# Altium schematic sheet 7_Analogue.SchDoc
size 420 x 297 mm; SheetNumber: 7; SheetTotal: 7
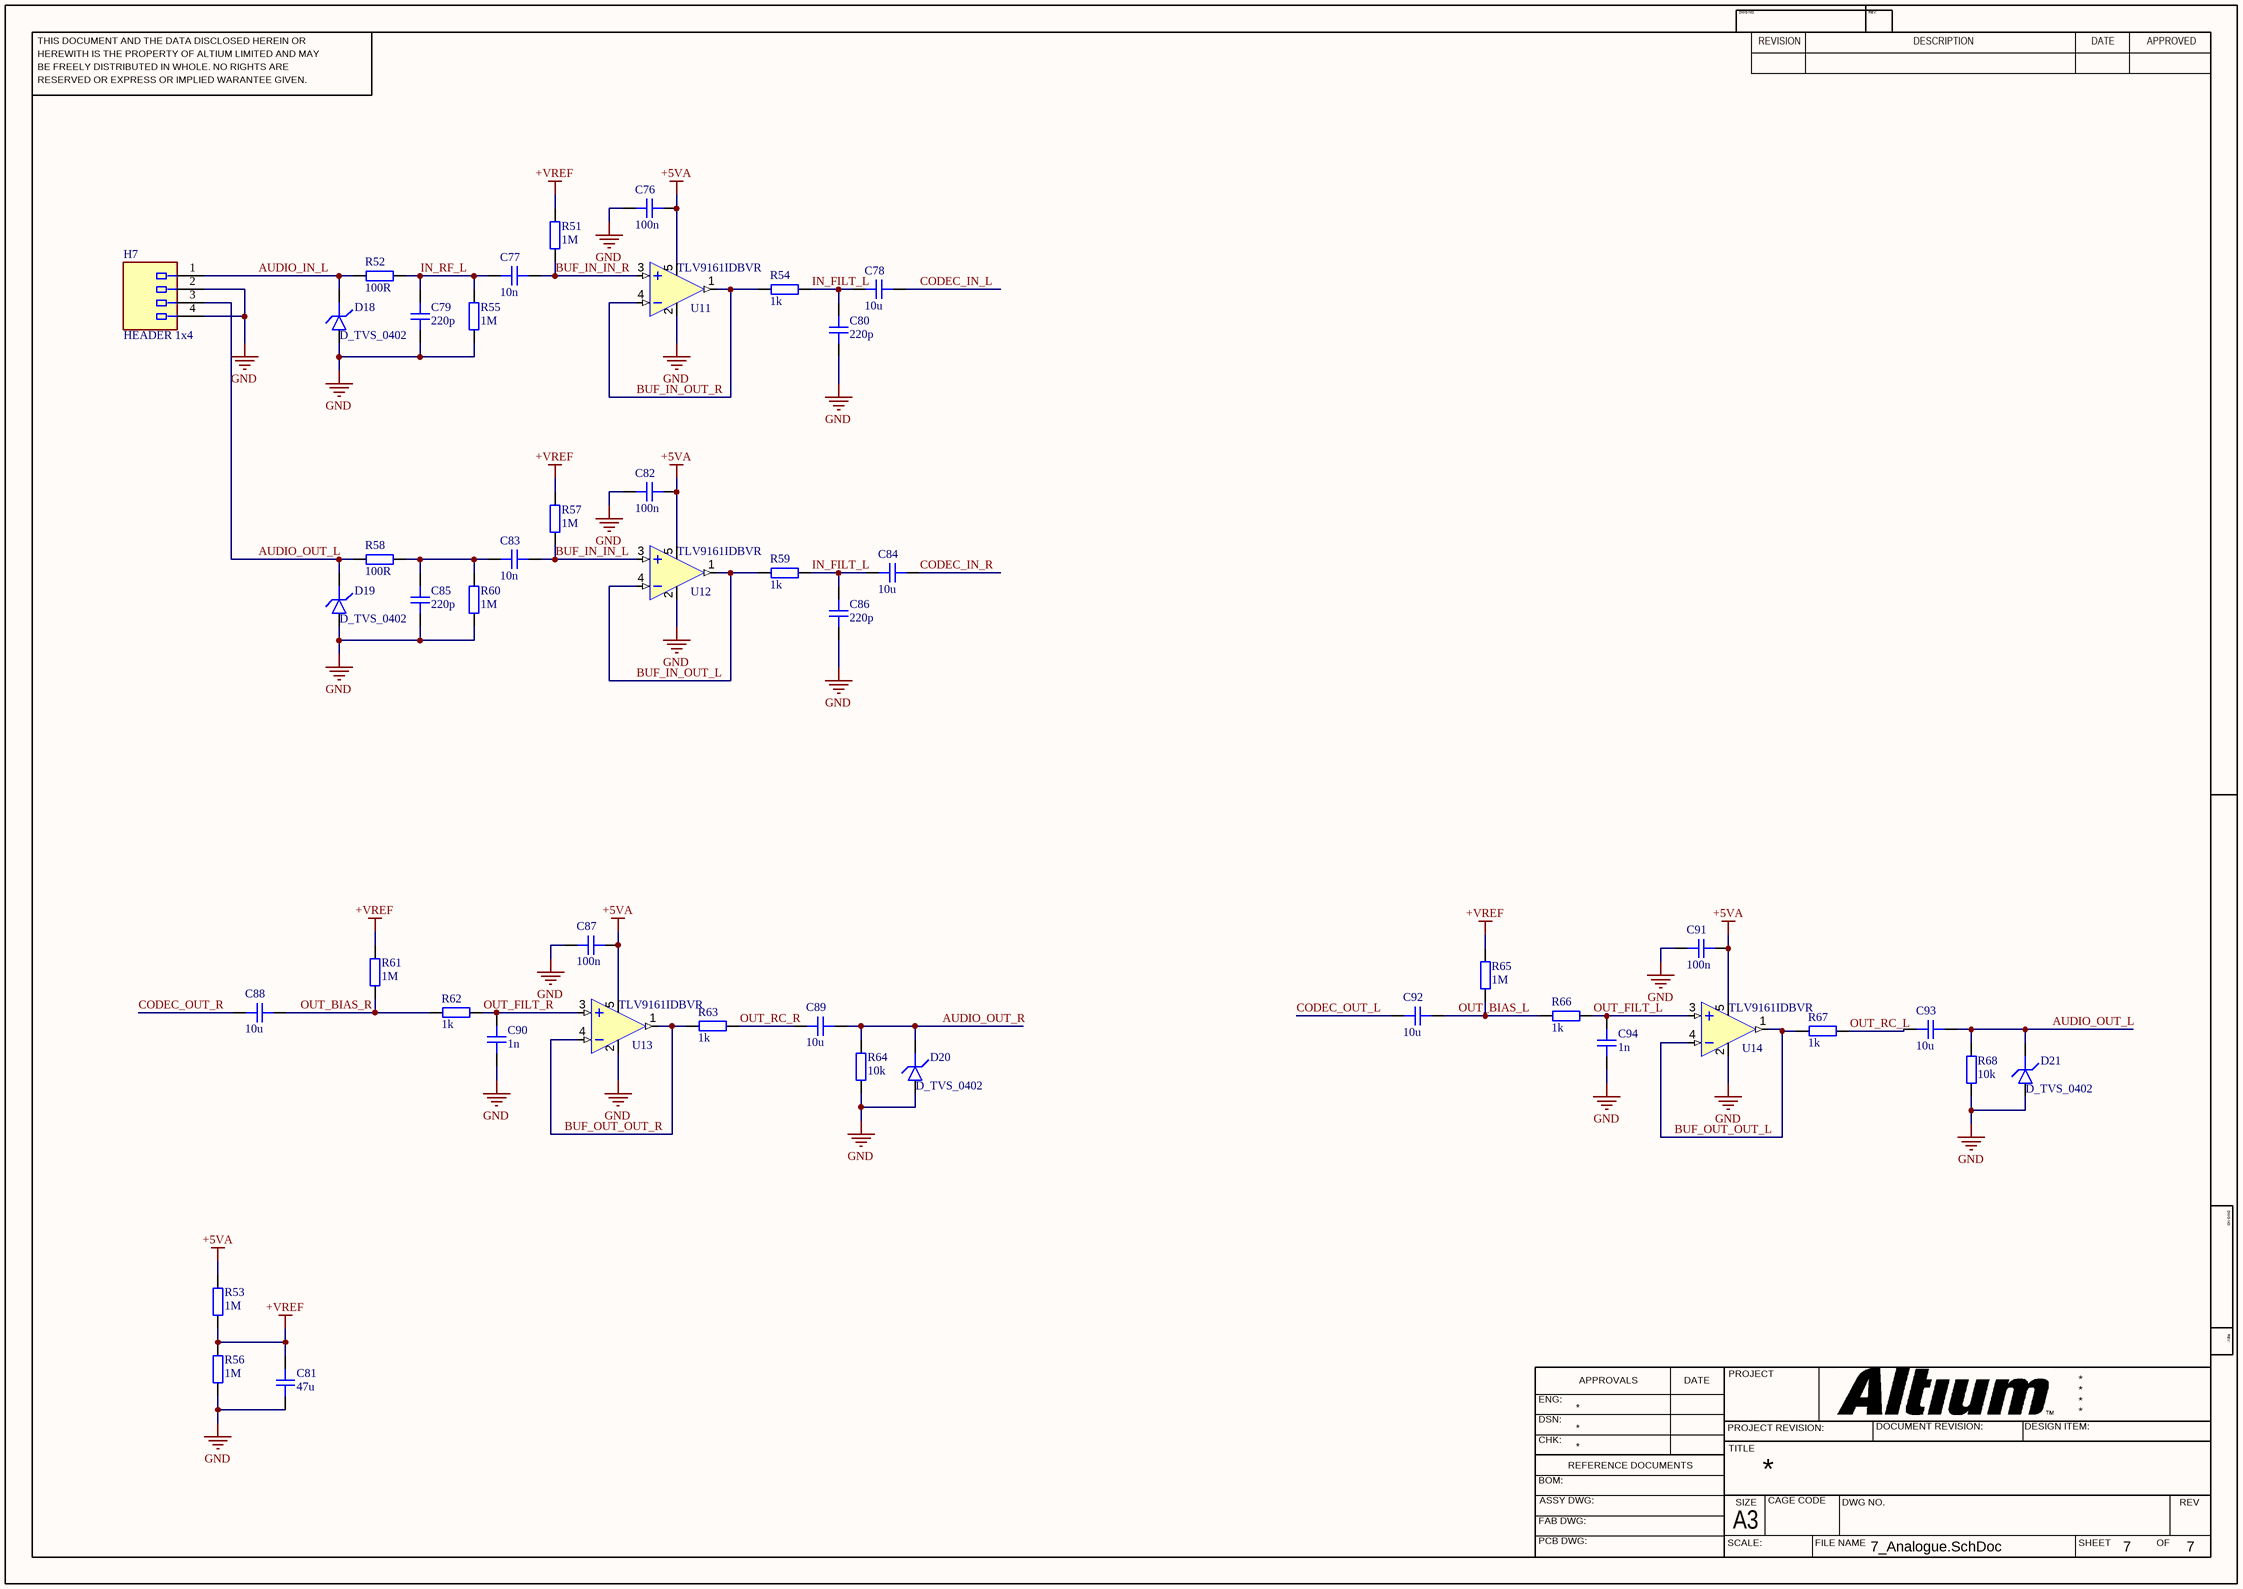
[diagram p0: 7_Analogue.SchDoc]

## Parts
C76  100n  [CAP_0402]
C77  10n  [CAP_0402]
C78  10u  [CAP_0402]
C79  220p  [CAP_0402]
C80  220p  [CAP_0402]
C81  47u  [CAP_0402]
C82  100n  [CAP_0402]
C83  10n  [CAP_0402]
C84  10u  [CAP_0402]
C85  220p  [CAP_0402]
C86  220p  [CAP_0402]
C87  100n  [CAP_0402]
C88  10u  [CAP_0402]
C89  10u  [CAP_0402]
C90  1n  [CAP_0402]
C91  100n  [CAP_0402]
C92  10u  [CAP_0402]
C93  10u  [CAP_0402]
C94  1n  [CAP_0402]
D18  D_TVS_0402  [D_0402]
D19  D_TVS_0402  [D_0402]
D20  D_TVS_0402  [D_0402]
D21  D_TVS_0402  [D_0402]
H7  HEADER 1x4  [053048-0410]
R51  1M  [RES_0402]
R52  100R  [RES_0402]
R53  1M  [RES_0402]
R54  1k  [RES_0402]
R55  1M  [RES_0402]
R56  1M  [RES_0402]
R57  1M  [RES_0402]
R58  100R  [RES_0402]
R59  1k  [RES_0402]
R60  1M  [RES_0402]
R61  1M  [RES_0402]
R62  1k  [RES_0402]
R63  1k  [RES_0402]
R64  10k  [RES_0402]
R65  1M  [RES_0402]
R66  1k  [RES_0402]
R67  1k  [RES_0402]
R68  10k  [RES_0402]
U11  TLV9161IDBVR  [SOT-23-5]
U12  TLV9161IDBVR  [SOT-23-5]
U13  TLV9161IDBVR  [SOT-23-5]
U14  TLV9161IDBVR  [SOT-23-5]

## Nets
+5VA: C76.1 C82.1 C87.1 C91.1 R53.2 U11.5(V+) U12.5(V+) U13.5(V+) U14.5(V+)
+VREF: C81.1 R51.2 R53.1 R56.2 R57.2 R61.2 R65.2
GND: C76.2 C79.1 C80.2 C81.2 C82.2 C85.1 C86.2 C87.2 C90.2 C91.2 C94.2 D18.A D19.A D20.A D21.A H7.2 H7.4 R55.1 R56.1 R60.1 R64.2 R68.2 U11.2(V-) U12.2(V-) U13.2(V-) U14.2(V-)
AUDIO_IN_L: D18.K H7.1 R52.1
AUDIO_OUT_L: C93.1 D19.K D21.K H7.3 R58.1 R68.1
AUDIO_OUT_R: C89.1 D20.K R64.1
BUF_IN_IN_L: C83.1 R57.1 U12.3(IN+)
BUF_IN_IN_R: C77.1 R51.1 U11.3(IN+)
BUF_IN_OUT_L: R59.2 U12.1(OUT) U12.4(IN-)
BUF_IN_OUT_R: R54.2 U11.1(OUT) U11.4(IN-)
BUF_OUT_OUT_L: R67.2 U14.1(OUT) U14.4(IN-)
BUF_OUT_OUT_R: R63.2 U13.1(OUT) U13.4(IN-)
CODEC_IN_L: C78.1
CODEC_IN_R: C84.1
CODEC_OUT_L: C92.2
CODEC_OUT_R: C88.2
IN_FILT_L: C78.2 C80.1 C84.2 C86.1 R54.1 R59.1
IN_RF_L: C77.2 C79.2 R52.2 R55.2
OUT_BIAS_L: C92.1 R65.1 R66.2
OUT_BIAS_R: C88.1 R61.1 R62.2
OUT_FILT_L: C94.1 R66.1 U14.3(IN+)
OUT_FILT_R: C90.1 R62.1 U13.3(IN+)
OUT_RC_L: C93.2 R67.1
OUT_RC_R: C89.2 R63.1
NetC83_2: C83.2 C85.2 R58.2 R60.2

## Notes on the sheet
- THIS DOCUMENT AND THE DATA DISCLOSED HEREIN OR
- HEREWITH IS THE PROPERTY OF ALTIUM LIMITED AND MAY
- DWG NO:
- REVISION
- REV:
- DESCRIPTION
- DATE
- APPROVED
- BE FREELY DISTRIBUTED IN WHOLE. NO RIGHTS ARE
- RESERVED OR EXPRESS OR IMPLIED WARANTEE GIVEN.
- ENG:
- APPROVALS
- PROJECT
- DSN:
- CHK:
- REFERENCE DOCUMENTS
- PROJECT REVISION:
- TITLE
- DOCUMENT REVISION:
- DESIGN ITEM:
- BOM:
- FAB DWG:
- PCB DWG:
- ASSY DWG:
- SCALE:
- A3
- SIZE
- CAGE CODE
- FILE NAME
- DWG NO.
- SHEET
- OF
- REV

## Library data of the parts
C76-C94 = CAP_0402: Capacitor SMD 0402; Manufacturer: *; Manufacturer Part Number: *; Distributor Link: *; LCSC: *; Rating: *; Dielectric: *
D18-D21 = D_TVS_0402: Diode TVS / ESD 0402
H7 = 053048-0410
R51-R68 = RES_0402: Resistor SMD 0402; Manufacturer: *; Manufacturer Part Number: *; Distributor Link: *; LCSC: *
U11-U14 = TLV9161IDBVR: TLV916x 16-V, 11-MHz, Rail-to-Rail Input/Output, Low Offset Voltage, Low Noise Op Amp SOT-23-5; Manufacturer: Texas Instruments; Manufacturer Part Number: TLV9161IDBVR